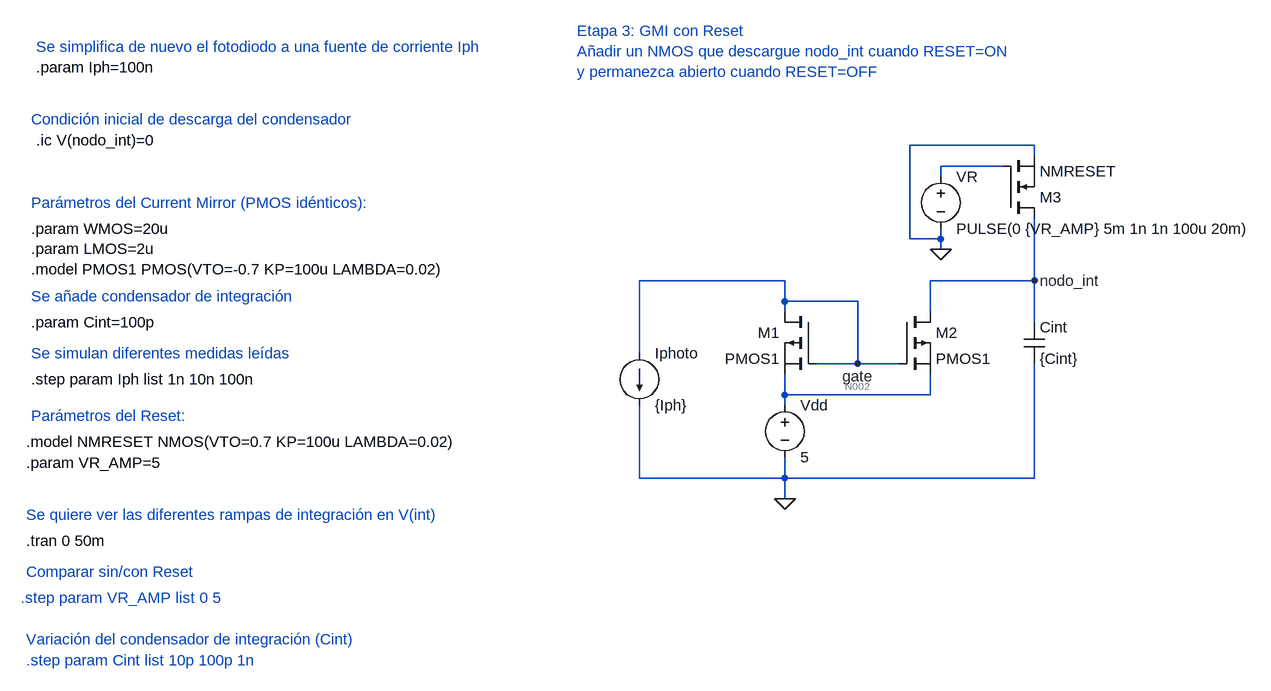
[diagram p0: schematic GMI_Etapa3.asc]
GMI_Etapa3.asc, the LTspice schematic file:
Version 4.1
SHEET 1 1300 1072
WIRE 768 256 576 256
WIRE 768 272 768 256
WIRE 720 288 624 288
WIRE 624 304 624 288
WIRE 576 400 576 256
WIRE 624 400 624 384
WIRE 624 400 576 400
WIRE 624 416 624 400
WIRE 384 464 160 464
WIRE 768 464 768 368
WIRE 768 464 608 464
WIRE 384 496 384 464
WIRE 496 496 384 496
WIRE 384 512 384 496
WIRE 608 512 608 464
WIRE 768 528 768 464
WIRE 160 576 160 464
WIRE 496 592 496 496
WIRE 496 592 432 592
WIRE 560 592 496 592
WIRE 384 640 384 608
WIRE 608 640 608 608
WIRE 608 640 384 640
WIRE 384 656 384 640
WIRE 160 768 160 656
WIRE 384 768 384 736
WIRE 384 768 160 768
WIRE 768 768 768 592
WIRE 768 768 384 768
WIRE 384 800 384 768
FLAG 384 800 0
FLAG 768 464 nodo_int
FLAG 496 592 gate
FLAG 624 416 0
SYMBOL voltage 384 640 R0
WINDOW 123 0 0 Left 0
WINDOW 39 0 0 Left 0
SYMATTR InstName Vdd
SYMATTR Value 5
SYMBOL current 160 576 R0
SYMATTR InstName Iphoto
SYMATTR Value {Iph}
SYMBOL cap 752 528 R0
SYMATTR InstName Cint
SYMATTR Value {Cint}
SYMBOL pmos 560 512 R0
SYMATTR InstName M2
SYMATTR Value PMOS1
SYMATTR SpiceLine L={LMOS} W={WMOS}
SYMBOL pmos 432 512 M0
SYMATTR InstName M1
SYMATTR Value PMOS1
SYMATTR SpiceLine L={LMOS} W={WMOS}
SYMBOL voltage 624 288 R0
SYMATTR InstName VR
SYMATTR Value PULSE(0 {VR_AMP} 5m 1n 1n 100u 20m)
SYMBOL nmos 720 368 M180
SYMATTR InstName M3
SYMATTR Value NMRESET
SYMATTR SpiceLine L={LMOS} W={WMOS}
TEXT 64 80 Left 2 ;Etapa 3: GMI con Reset\nAñadir un NMOS que descargue nodo_int cuando RESET=ON\ny permanezca abierto cuando RESET=OFF
TEXT -776 384 Left 2 !.param WMOS=20u\n.param LMOS=2u\n.model PMOS1 PMOS(VTO=-0.7 KP=100u LAMBDA=0.02)
TEXT -776 616 Left 2 !.step param Iph list 1n 10n 100n
TEXT -776 344 Left 2 ;Parámetros del Current Mirror (PMOS idénticos):
TEXT -768 104 Left 2 ;Se simplifica de nuevo el fotodiodo a una fuente de corriente Iph
TEXT -768 136 Left 2 !.param Iph=100n
TEXT -776 576 Left 2 ;Se simulan diferentes medidas leídas
TEXT -784 864 Left 2 !.tran 0 50m
TEXT -776 488 Left 2 ;Se añade condensador de integración
TEXT -776 528 Left 2 !.param Cint=100p
TEXT -784 824 Left 2 ;Se quiere ver las diferentes rampas de integración en V(int)
TEXT -768 248 Left 2 !.ic V(nodo_int)=0
TEXT -776 216 Left 2 ;Condición inicial de descarga del condensador
TEXT -776 672 Left 2 ;Parámetros del Reset:
TEXT -784 712 Left 2 !.model NMRESET NMOS(VTO=0.7 KP=100u LAMBDA=0.02)
TEXT -784 744 Left 2 !.param VR_AMP=5
TEXT -784 1016 Left 2 ;Variación del condensador de integración (Cint)
TEXT -784 1048 Left 2 ;.step param Cint list 10p 100p 1n
TEXT -784 912 Left 2 ;Comparar sin/con Reset
TEXT -792 952 Left 2 ;.step param VR_AMP list 0 5

The netlist it stands for:
* GMI_Etapa3.asc
Vdd N002 0 5
Iphoto gate 0 {Iph}
Cint nodo_int 0 {Cint}
M2 nodo_int gate N002 N002 PMOS1 L={LMOS} W={WMOS}
M1 gate gate N002 N002 PMOS1 L={LMOS} W={WMOS}
VR N001 0 PULSE(0 {VR_AMP} 5m 1n 1n 100u 20m)
M3 nodo_int N001 0 0 NMRESET L={LMOS} W={WMOS}
.model NMOS NMOS
.model PMOS PMOS
.lib standard.mos
* Etapa 3: GMI con Reset
* Añadir un NMOS que descargue nodo_int cuando RESET=ON
* y permanezca abierto cuando RESET=OFF
.param WMOS=20u
.param LMOS=2u
.model PMOS1 PMOS(VTO=-0.7 KP=100u LAMBDA=0.02)
.step param Iph list 1n 10n 100n
* Parámetros del Current Mirror (PMOS idénticos):
* Se simplifica de nuevo el fotodiodo a una fuente de corriente Iph
.param Iph=100n
* Se simulan diferentes medidas leídas
.tran 0 50m
* Se añade condensador de integración
.param Cint=100p
* Se quiere ver las diferentes rampas de integración en V(int)
.ic V(nodo_int)=0
* Condición inicial de descarga del condensador
* Parámetros del Reset:
.model NMRESET NMOS(VTO=0.7 KP=100u LAMBDA=0.02)
.param VR_AMP=5
* Variación del condensador de integración (Cint)
* .step param Cint list 10p 100p 1n
* Comparar sin/con Reset
* .step param VR_AMP list 0 5
.backanno
.end

* Results of the author's LTspice run, read from the files saved beside the schematic
* Operating Point (first step), zero values left out:
*   V(gate) = 4.298 V
*   V(n002) = 5 V
*   I(Iphoto) = 1 nA
*   I(Vdd) = -2.094 nA
*   Ib(M2) = 5.01 pA
*   Id(M1) = -2.885 nA
*   Id(M2) = -3.138 nA
*   Is(M1) = 2.884 nA
*   Is(M2) = 3.133 nA
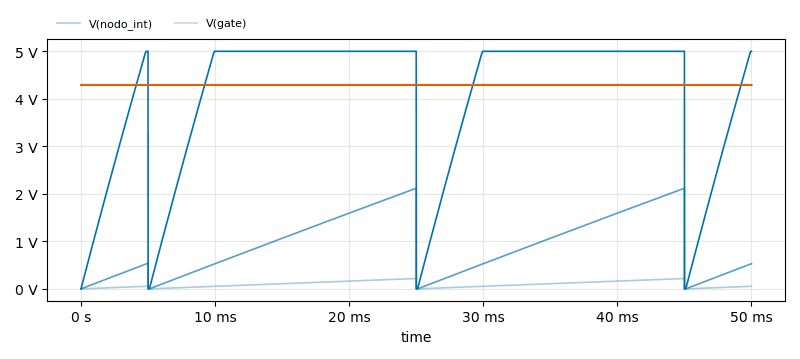
[diagram p1: Transient Analysis of GMI_Etapa3.asc, plotted from the saved traces]
* Transient Analysis, 3 runs:
*   V(nodo_int) [iph=1e-09]: min 0 V, max 217 mV, average 91.81 mV, rms 112.7 mV, last 53.54 mV
*   V(nodo_int) [iph=1e-08]: min 0 V, max 2.118 V, average 901.5 mV, rms 1.105 V, last 529.3 mV
*   V(nodo_int) [iph=1e-07]: min 0 V, max 5.002 V, average 4.019 V, rms 4.299 V, last 5 V
*   V(gate) [iph=1e-09]: min 4.298 V, max 4.299 V, average 4.299 V, rms 4.299 V, last 4.299 V
*   V(gate) [iph=1e-08]: min 4.294 V, max 4.296 V, average 4.296 V, rms 4.296 V, last 4.296 V
*   V(gate) [iph=1e-07]: min 4.286 V, max 4.286 V, average 4.286 V, rms 4.286 V, last 4.286 V